# EAGLE design Segliment_Display (EAGLE 9.2.0)
CHECKED: Yes; COMPANY: Unexpected Maker; DATE: 11 Oct 2018; DRAWN: Seon; DRGNO: 1; REV: 2; TITLE: Segliment Display
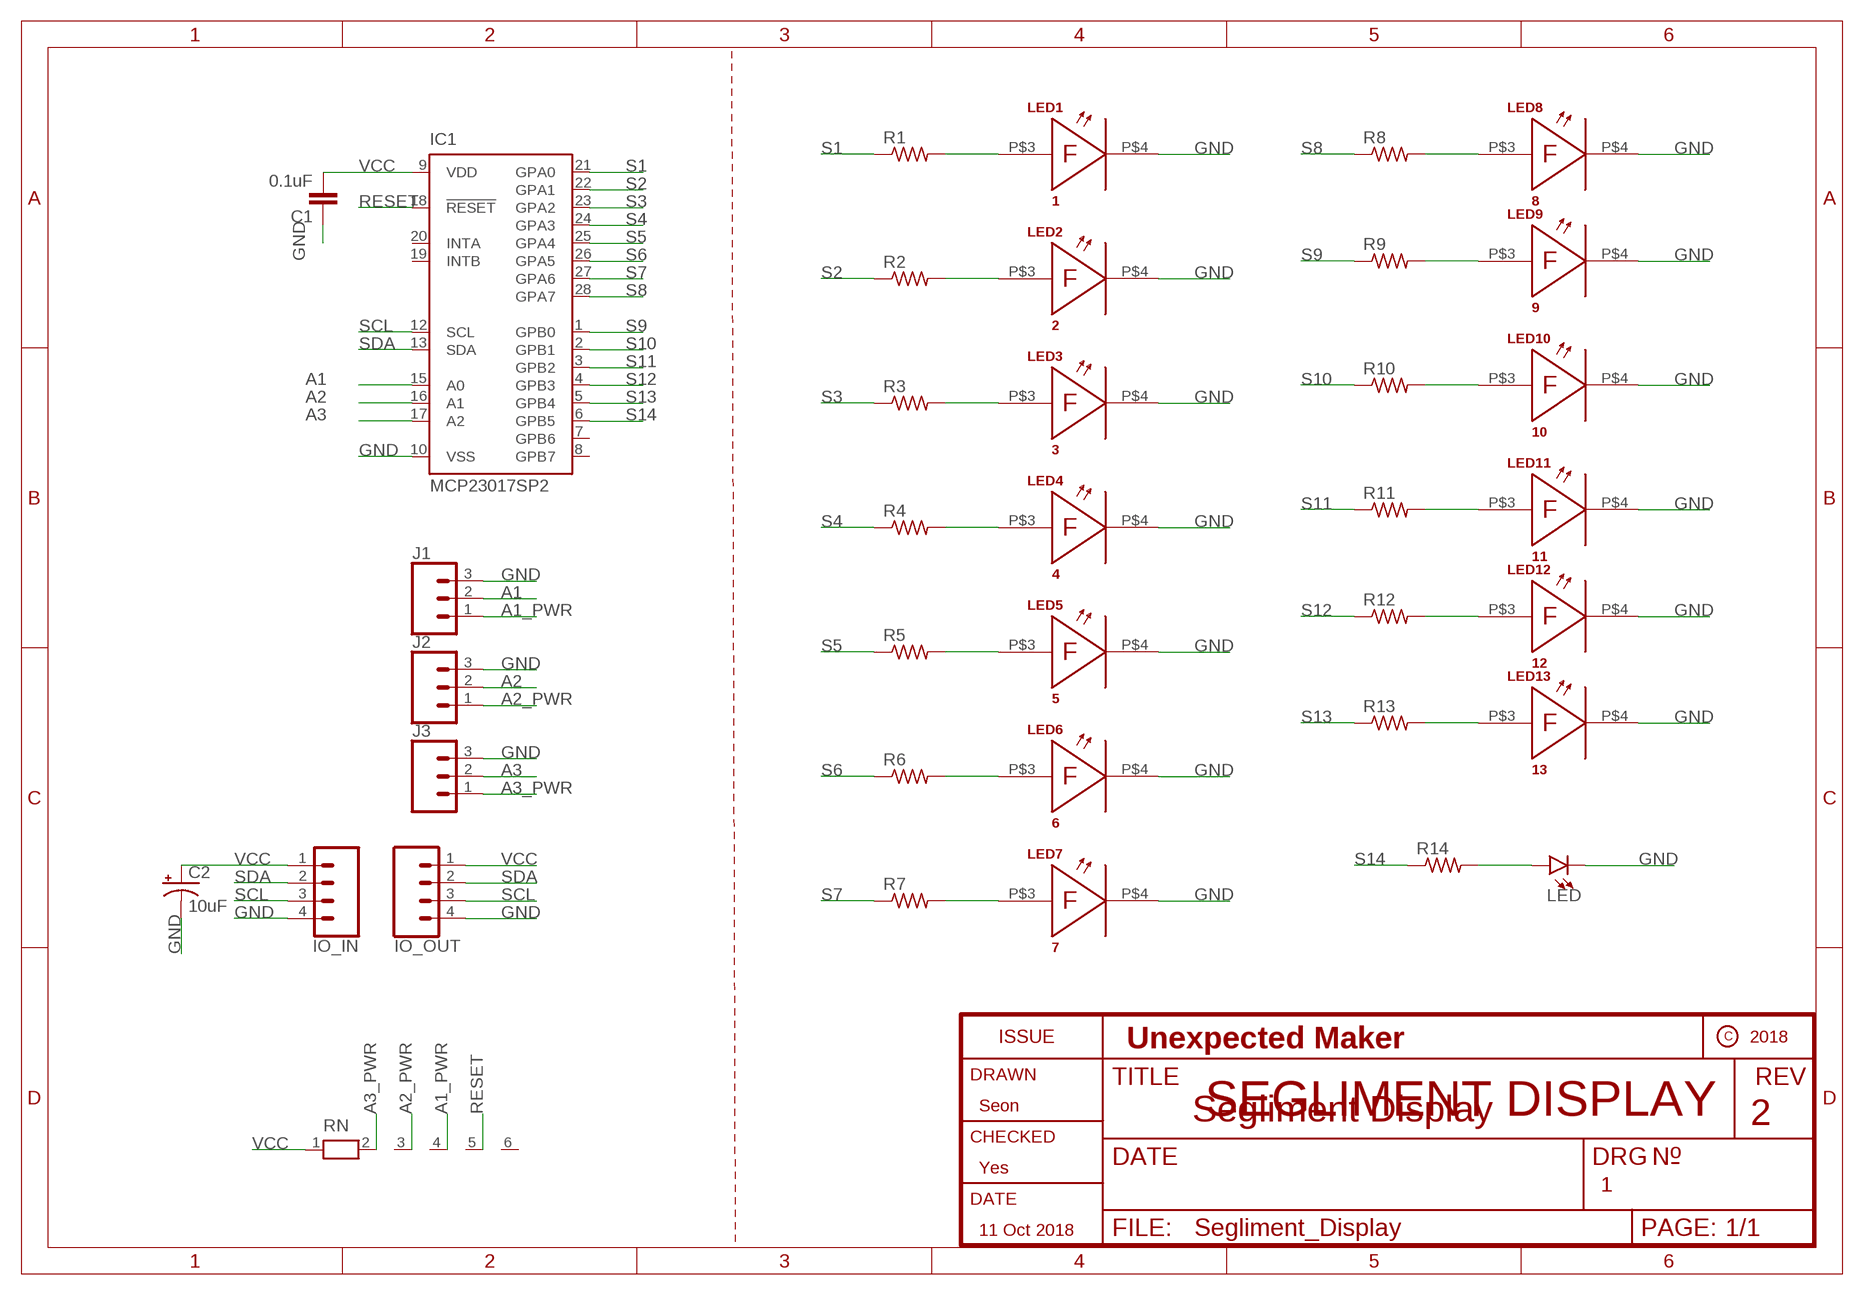
[diagram p0: schematic, sheet 1]

## Parts
C1  0.1uF  0.1UF-KIT-EZ-50V-20%  [CAP-PTH-SMALL-KIT]
C2  10uF  10UF-POLAR-RADIAL-2.5MM-25V-20%  [CPOL-RADIAL-2.5MM-5MM]
IC1  MCP23017SP2  [DIL28-3-ROUND]
IO_IN  CONN_041X04_NO_SILK  [1X04_NO_SILK]
IO_OUT  CONN_041X04_NO_SILK  [1X04_NO_SILK]
J1  CONN_031X03_NO_SILK  [1X03_NO_SILK]
J2  CONN_031X03_NO_SILK  [1X03_NO_SILK]
J3  CONN_031X03_NO_SILK  [1X03_NO_SILK]
LED  LED3MM  [LED_3MM]
LED1  1  LED28-30MMRAISED  [RAISED]
LED2  2  LED28-30MMRAISED  [RAISED]
LED3  3  LED28-30MMRAISED  [RAISED]
LED4  4  LED28-30MMRAISED  [RAISED]
LED5  5  LED28-30MMRAISED  [RAISED]
LED6  6  LED28-30MMRAISED  [RAISED]
LED7  7  LED28-30MMRAISED  [RAISED]
LED8  8  LED28-30MMRAISED  [RAISED]
LED9  9  LED28-30MMRAISED  [RAISED]
LED10  10  LED28-30MMRAISED  [RAISED]
LED11  11  LED28-30MMRAISED  [RAISED]
LED12  12  LED28-30MMRAISED  [RAISED]
LED13  13  LED28-30MMRAISED  [RAISED]
R1  R-US_0207/7  [0207/7]
R2  R-US_0207/7  [0207/7]
R3  R-US_0207/7  [0207/7]
R4  R-US_0207/7  [0207/7]
R5  R-US_0207/7  [0207/7]
R6  R-US_0207/7  [0207/7]
R7  R-US_0207/7  [0207/7]
R8  R-US_0207/7  [0207/7]
R9  R-US_0207/7  [0207/7]
R10  R-US_0207/7  [0207/7]
R11  R-US_0207/7  [0207/7]
R12  R-US_0207/7  [0207/7]
R13  R-US_0207/7  [0207/7]
R14  R-US_0207/7  [0207/7]
RN  RN05  [RN-6]

## Nets
A1: IC1.15(A0) J1.2
A1_PWR: J1.1 RN.4
A2: IC1.16(A1) J2.2
A2_PWR: J2.1 RN.3
A3: IC1.17(A2) J3.2
A3_PWR: J3.1 RN.2
GND: C1.1 C2.2(-) IC1.10(VSS) IO_IN.4 IO_OUT.4 J1.3 J2.3 J3.3 LED1.P$4 LED2.P$4 LED3.P$4 LED4.P$4 LED5.P$4 LED6.P$4 LED7.P$4 LED8.P$4 LED9.P$4 LED10.P$4 LED11.P$4 LED12.P$4 LED13.P$4 LED.K(C)
N$1: LED1.P$3 R1.2
N$2: LED.A R14.2
N$3: LED2.P$3 R2.2
N$5: LED3.P$3 R3.2
N$7: LED4.P$3 R4.2
N$9: LED5.P$3 R5.2
N$11: LED6.P$3 R6.2
N$13: LED7.P$3 R7.2
N$15: LED8.P$3 R8.2
N$17: LED9.P$3 R9.2
N$19: LED10.P$3 R10.2
N$21: LED11.P$3 R11.2
N$23: LED12.P$3 R12.2
N$25: LED13.P$3 R13.2
RESET: IC1.18(!RESET) RN.5
S1: IC1.21(GPA0) R1.1
S2: IC1.22(GPA1) R2.1
S3: IC1.23(GPA2) R3.1
S4: IC1.24(GPA3) R4.1
S5: IC1.25(GPA4) R5.1
S6: IC1.26(GPA5) R6.1
S7: IC1.27(GPA6) R7.1
S8: IC1.28(GPA7) R8.1
S9: IC1.1(GPB0) R9.1
S10: IC1.2(GPB1) R10.1
S11: IC1.3(GPB2) R11.1
S12: IC1.4(GPB3) R12.1
S13: IC1.5(GPB4) R13.1
S14: IC1.6(GPB5) R14.1
SCL: IC1.12(SCL) IO_IN.3 IO_OUT.3
SDA: IC1.13(SDA) IO_IN.2 IO_OUT.2
VCC: C1.2 C2.1(+) IC1.9(VDD) IO_IN.1 IO_OUT.1 RN.1
Unconnected: IC1.7(GPB6) IC1.8(GPB7) IC1.19(INTB) IC1.20(INTA) RN.6

## Notes on the sheet
- SEGLIMENT DISPLAY

## Library data of the parts
C1 = SparkFun-Capacitors:0.1UF: 0.1µF ceramic capacitors A capacitor is a passive two-terminal electrical component used to store electrical energy temporarily in an electric field.; PROD_ID: CAP-08370
C2 = SparkFun-Capacitors:10UF-POLAR: 10.0µF polarized capacitors A capacitor is a passive two-terminal electrical component used to store electrical energy temporarily in an electric field.; PROD_ID: CAP-08440
IC1 = adafruit:MCP23017: http://ww1.microchip.com/downloads/en/DeviceDoc/21952a.pdf Source: http://ww1.microchip.com/downloads/en/DeviceDoc/21952a.pdf
IO_IN IO_OUT = SparkFun-Connectors:CONN_04: Multi connection point. Often used as Generic Header-pin footprint for 0.1 inch spaced/style header connections On any of the 0.1 inch spaced packages, you can populate with these: Break Away Headers - Straight <https://www.sparkfun.com/products/116> (PRT-00116) Break Away Male Headers - Right Angle <https://www.sparkfun.com/products/553> (PRT-00553) Female Headers <https://www.sparkfun.com/products/115> (PRT-00115) Break Away Headers - Machine Pin <https://www.sparkfun.com/products/117> (PRT-00117) Break Away Female Headers - Swiss Machine Pin <https://www.sparkfun.com/products/743> (PRT-00743) For SCREWTERMINALS and SPRING TERMINALS visit here: Screw Terimnals on SparkFun.com <https://www.sparkfun.com/search/results?term=Screw+Terminals> (5mm/3.5mm/2.54mm spacing) This device is also useful as a general connection point to wire up your design to another part of your project. Our various solder wires solder well into these plated through hole pads. Hook-Up Wire - Assortment (Stranded, 22 AWG) <https://www.sparkfun.com/products/11375> (PRT-11375) Hook-Up Wire - Assortment (Solid Core, 22 AWG) <https://www.sparkfun.com/products/11367> (PRT-11367) View the entire wire category on our website here <https://www.sparkfun.com/categories/141> Special notes: Molex polarized connector foot print use with SKU : PRT-08231 with associated crimp pins and housings. 1MM SMD Version SKU: PRT-10208; PROD_ID: CONN-09696
J1-J3 = SparkFun-Connectors:CONN_03: Multi connection point. Often used as Generic Header-pin footprint for 0.1 inch spaced/style header connections On any of the 0.1 inch spaced packages, you can populate with these: Break Away Headers - Straight <https://www.sparkfun.com/products/116> (PRT-00116) Break Away Male Headers - Right Angle <https://www.sparkfun.com/products/553> (PRT-00553) Female Headers <https://www.sparkfun.com/products/115> (PRT-00115) Break Away Headers - Machine Pin <https://www.sparkfun.com/products/117> (PRT-00117) Break Away Female Headers - Swiss Machine Pin <https://www.sparkfun.com/products/743> (PRT-00743) Stackable Header - 3 Pin (Female, 0.1") <https://www.sparkfun.com/products/13875> (PRT-13875) For SCREWTERMINALS and SPRING TERMINALS visit here: Screw Terimnals on SparkFun.com <https://www.sparkfun.com/search/results?term=Screw+Terminals> (5mm/3.5mm/2.54mm spacing) This device is also useful as a general connection point to wire up your design to another part of your project. Our various solder wires solder well into these plated through hole pads. Hook-Up Wire - Assortment (Stranded, 22 AWG) <https://www.sparkfun.com/products/11375> (PRT-11375) Hook-Up Wire - Assortment (Solid Core, 22 AWG) <https://www.sparkfun.com/products/11367> (PRT-11367) View the entire wire category on our website here <https://www.sparkfun.com/categories/141> Special notes: Molex polarized connector foot print use with SKU : PRT-08232 with associated crimp pins and housings.
LED = SparkFun-LED:LED: LED (Generic) Standard schematic elements and footprints for 5mm, 3mm, 1206, and 0603 sized LEDs. Generic LEDs with no color specified.; PROD_ID: DIO-08794
LED1-LED13 = Filament2LEDs:LED28-30MM: This is a filament LED
R1-R14 = resistor:R-US_: RESISTOR, American symbol
RN = resistor-net:RN05: RESISTOR NETWORK; OC_FARNELL: unknown; OC_NEWARK: unknown

## Board
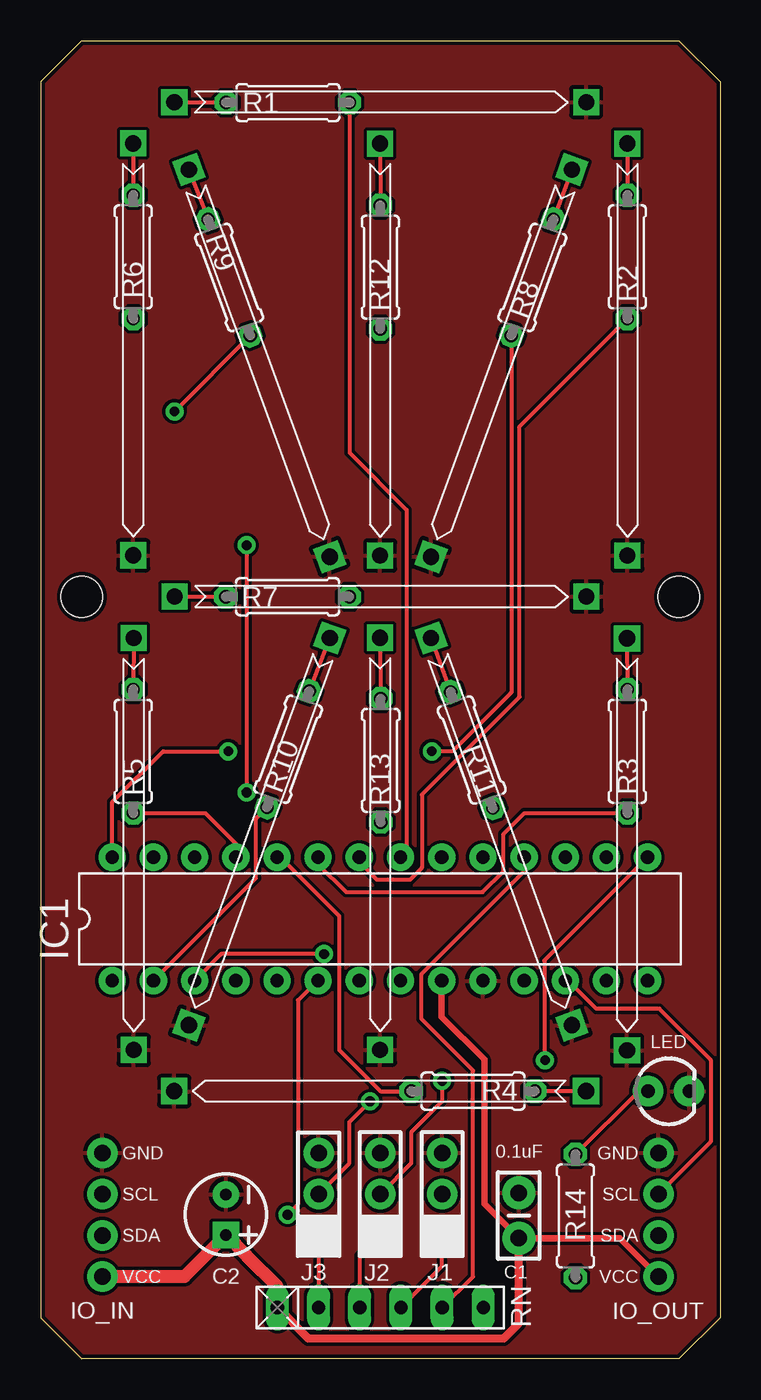
[diagram p1: board, top side]
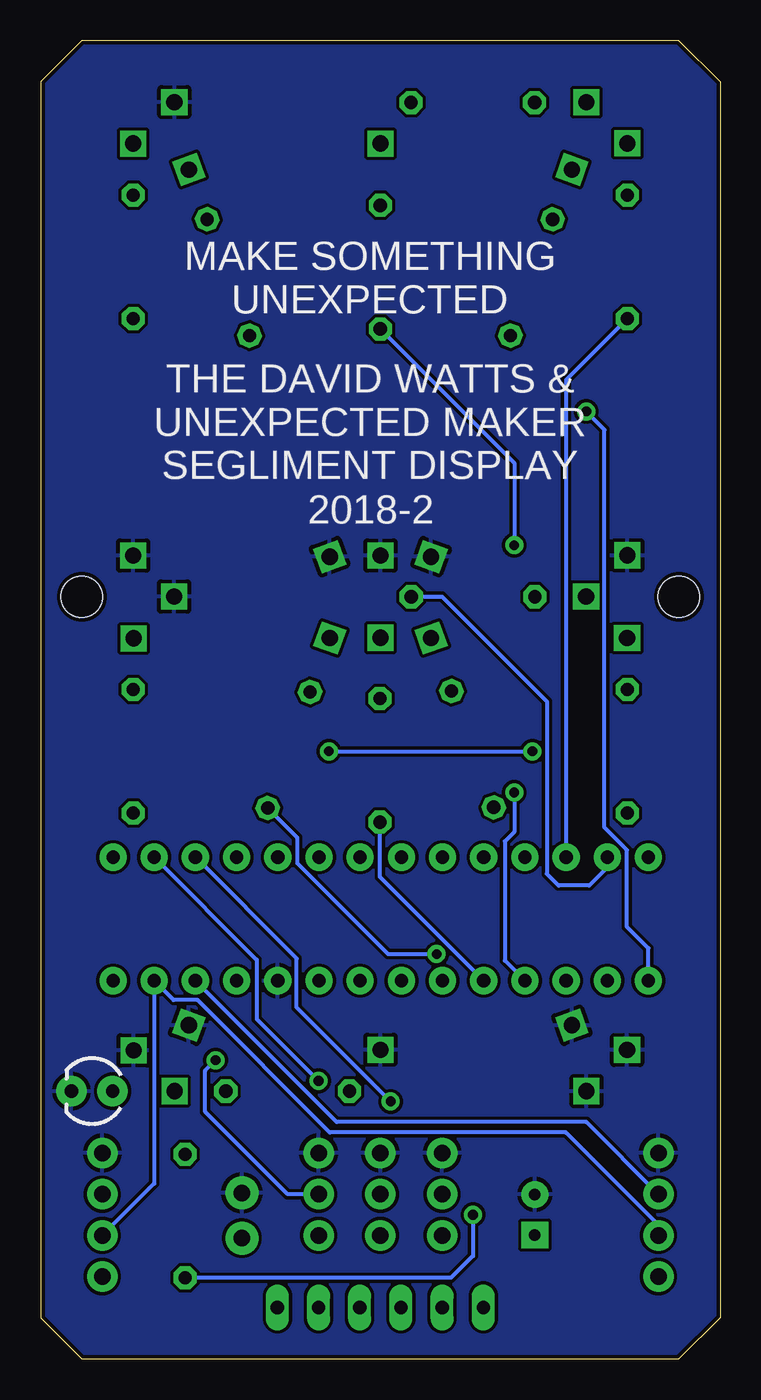
[diagram p2: board, bottom side, seen from below]

Size 41.91 x 81.28 mm. Coordinates in mm from the lower left corner, seen from the top.
Outline: 0,78.74 0,2.54 2.54,0 39.37,0 41.91,2.54 41.91,78.74 39.37,81.28 2.54,81.28 0,78.74
Copper layers (1*16): Top 0.035mm / dielectric 1.5mm / Bottom 0.035mm
Design rules "SparkFun": minimum track width 8mil, minimum drill 20mil, track to track 8mil, track to pad 8mil, pad to pad 8mil, via to via 8mil, smd to smd 8mil, copper to edge 10mil, drill to drill 8mil, minimum pad ring 12mil, minimum via ring 10mil, stop-mask expansion 4mil, vias tented up to drill 25mil, thermal gap 10mil
Holes 2.54 mm at 2.54,46.99 39.37,46.99

### Footprints (pad centres in the part's own frame; a part is rotated, then mirrored left to right if it is on the bottom)
CAP-PTH-SMALL-KIT = drill 1.016 pad 2.032: 1 -1.397,0; 2 1.397,0
CPOL-RADIAL-2.5MM-5MM = drill 0.7 pad 1.651 square: 1 1.25,0 | drill 0.7 pad 1.651: 2 -1.25,0
DIL28-3-ROUND = drill 0.813 pad 1.676: 1 -16.51,-3.81; 2 -13.97,-3.81; 3 -11.43,-3.81; 4 -8.89,-3.81; 5 -6.35,-3.81; 6 -3.81,-3.81; 7 -1.27,-3.81; 8 1.27,-3.81; 9 3.81,-3.81; 10 6.35,-3.81; 11 8.89,-3.81; 12 11.43,-3.81; 13 13.97,-3.81; 14 16.51,-3.81; 15 16.51,3.81; 16 13.97,3.81; 17 11.43,3.81; 18 8.89,3.81; 19 6.35,3.81; 20 3.81,3.81; 21 1.27,3.81; 22 -1.27,3.81; 23 -3.81,3.81; 24 -6.35,3.81; 25 -8.89,3.81; 26 -11.43,3.81; 27 -13.97,3.81; 28 -16.51,3.81
1X04_NO_SILK = drill 1.016 pad 1.88: 1 0,0; 2 2.54,0; 3 5.08,0; 4 7.62,0
1X03_NO_SILK = drill 1.016 pad 1.88: 1 0,0; 2 2.54,0; 3 5.08,0
LED_3MM = drill 0.813 pad 1.88: A -1.27,0; K 1.27,0
RAISED = drill 1 square: P$3 -12.7,0; P$4 12.7,0
0207/7 = drill 0.813 octagon: 1 -3.81,0; 2 3.81,0
RN-6 = drill 0.813 long: 1 -6.35,0; 2 -3.81,0; 3 -1.27,0; 4 1.27,0; 5 3.81,0; 6 6.35,0

### Placement (x,y rotation side)
C1  29.49,8.84 270 top
C2  11.43,8.89 270 top
IC1  20.93,27.13 0 top
IO_IN  3.81,5.08 90 top
IO_OUT  38.1,5.08 90 top
J1  24.77,7.62 90 top
J2  20.95,7.62 90 top
J3  17.15,7.62 90 top
LED  38.73,16.51 0 top
LED1  20.95,77.48 0 top
LED2  36.2,62.23 270 top
LED3  36.17,31.72 270 top
LED4  20.94,16.51 180 top
LED5  5.74,31.75 270 top
LED6  5.71,62.24 270 top
LED7  20.97,47 0 top
LED8  28.42,61.39 250 top
LED9  13.49,61.39 290 top
LED10  13.49,32.51 250 top
LED11  28.42,32.51 290 top
LED12  20.94,62.23 270 top
LED13  20.94,31.76 270 top
R1  15.25,77.46 180 top
R2  36.2,67.94 90 top
R3  36.2,37.47 90 top
R4  26.67,16.51 0 top
R5  5.71,37.47 90 top
R6  5.71,67.94 90 top
R7  15.24,46.99 180 top
R8  30.33,66.67 70 top
R9  11.63,66.67 110 top
R10  15.27,37.59 70 top
R11  26.59,37.54 110 top
R12  20.95,67.31 90 top
R13  20.98,36.91 90 top
R14  32.99,8.81 90 top
RN  20.95,3.17 0 top

### Tracks (layer width: path | path; a pad name or v marks a point on that pad's centre or on a via)
A1  (via drill 0.6)
  Top 0.254: IC1.15 31.06,24.56 31.06,18.47 v31.12,18.41
  Bottom 0.254: J1.2 26.67,10.16 31.75,15.24 31.75,17.78 v31.12,18.41
A1_PWR
  Top 0.254: RN.4 24.77,5.72 J1.1
A2  (via drill 0.6)
  Top 0.254: J2.2 22.86,12.06 22.86,13.97 24.77,15.88 v24.77,17.14
  Bottom 0.254: v24.77,17.14 28.58,20.95 28.58,24.61 IC1.16
A2_PWR
  Top 0.254: J2.1 19.69,6.35 RN.3
A3  (via drill 0.6)
  Top 0.254: v20.32,15.88 19.05,14.61 19.05,12.06 J3.2
  Bottom 0.254: IC1.17 26.11,24.69 26.11,21.67 v20.32,15.88
A3_PWR
  Top 0.254: J3.1 RN.2
GND
  pour Top: -1.27,82.55 -1.27,-1.27 42.55,-1.27 42.55,82.55
  pour Bottom: -3.81,85.09 -3.81,-3.17 47.63,-3.17 47.63,85.09
N$1
  Top 0.254: R1.2 8.28,77.46 LED1.P$3
N$2
  Top 0.254: R14.2 36.88,16.51 LED.A
N$3
  Top 0.254: LED2.P$3 R2.2
N$5
  Top 0.254: LED3.P$3 R3.2
N$7
  Top 0.254: LED4.P$3 R4.2
N$9
  Top 0.254: LED5.P$3 R5.2
N$11
  Top 0.254: LED6.P$3 R6.2
N$13
  Top 0.254: LED7.P$3 R7.2
N$15
  Top 0.254: LED8.P$3 R8.2
N$17
  Top 0.254: LED9.P$3 R9.2
N$19
  Top 0.254: LED10.P$3 R10.2
N$21
  Top 0.254: LED11.P$3 R11.2
N$23
  Top 0.254: LED12.P$3 R12.2
N$25
  Top 0.254: LED13.P$3 R13.2
RESET
  Top 0.254: IC1.18 29.82,30.05 23.49,23.72 23.49,20.95 26.67,17.78 26.67,5.08 RN.5
S1
  Top 0.254: R1.1 19.06,55.87 22.58,52.35 22.58,31.32 IC1.21
S2
  Top 0.254: R2.1 29.54,57.48 29.54,40.82 23.52,34.8 23.52,30.27 22.79,29.54 20.75,29.54 19.66,30.63 IC1.22
S3
  Top 0.254: R3.1 29.84,33.66 28.55,32.36 28.55,30.07 27.26,28.78 18.84,28.78 17.12,30.5 IC1.23
S4
  Top 0.254: IC1.24 14.78,30.94 18.41,27.3 18.41,19.05 20.96,16.51 R4.1
S5
  Top 0.254: R5.1 10.16,33.66 12.04,31.78 IC1.25
S6
  Bottom 0.254: R6.1 9.5,60.35 IC1.26
S7
  Bottom 0.254: R7.1 17.15,46.99 10.69,40.54 10.69,29.91 9.96,29.18 8.08,29.18 6.96,30.3 IC1.27
S8  (via drill 0.6)
  Top 0.254: R8.1 29.02,41.09 25.4,37.47 v24.13,37.47 | v11.58,37.47 7.56,37.47 4.42,34.32 IC1.28
  Bottom 0.254: v24.13,37.47 v11.58,37.47
S9  (via drill 0.6)
  Top 0.254: R9.1 v8.26,58.41
  Bottom 0.254: IC1.1 4.42,25.32 5.74,26.64 5.74,31.37 7.13,32.76 7.13,57.29 v8.26,58.41
S10
  Top 0.254: R10.1 13.28,33.33 13.28,29.85 13.28,29.64 IC1.2
S11  (via drill 0.6)
  Top 0.254: v17.48,24.96 11.14,24.96 IC1.3
  Bottom 0.254: R11.1 26.09,32.15 26.09,30.58 20.47,24.96 v17.48,24.96
S12  (via drill 0.6)
  Top 0.254: v12.7,50.16 v12.7,34.93
  Bottom 0.254: R12.1 12.7,55.25 v12.7,50.16 | v12.7,34.93 12.7,32.49 13.28,31.91 13.28,24.56 IC1.4
S13
  Bottom 0.254: IC1.5 20.98,29.72 R13.1
S14  (via drill 0.6)
  Top 0.254: IC1.6 17.08,23.32 15.88,22.12 15.88,9.52 v15.24,8.89
  Bottom 0.254: v15.24,8.89 15.24,6.35 16.59,5 R14.1
SCL
  Top 0.254: IC1.12 32.56,23.32 34.29,21.59 38.17,21.59 41.33,18.43 41.33,13.39 IO_OUT.3
  Bottom 0.254: IO_IN.3 8.26,14.61 23.65,14.61 IC1.12
SDA
  Bottom 0.254: IO_OUT.2 34.9,10.82 IC1.13 33.71,22.13 32.23,22.13 24.08,13.97 9.53,13.97 3.81,8.25 IO_IN.2
VCC
  Top 0.406: IC1.9 24.74,21.09 27.36,18.47 27.36,9.57 C1.2 35.74,7.44 IO_OUT.1
  Top 0.508: RN.1 16.51,1.27 28.58,1.27 29.49,2.18 C1.2
  Top 0.813: RN.1 14.61,4.44 12.72,6.33 12.72,6.35 C2.1 8.87,5.08 IO_IN.1

### Text on the board
tPlace: GND | 0.1uF | GND | SCL | SCL | SDA | SDA | VCC | C1 | VCC
bPlace: MAKE SOMETHING / UNEXPECTED | THE DAVID WATTS & / UNEXPECTED MAKER / SEGLIMENT DISPLAY | 2018-2